# EAGLE design usb_stepper_controller (EAGLE 5.06)
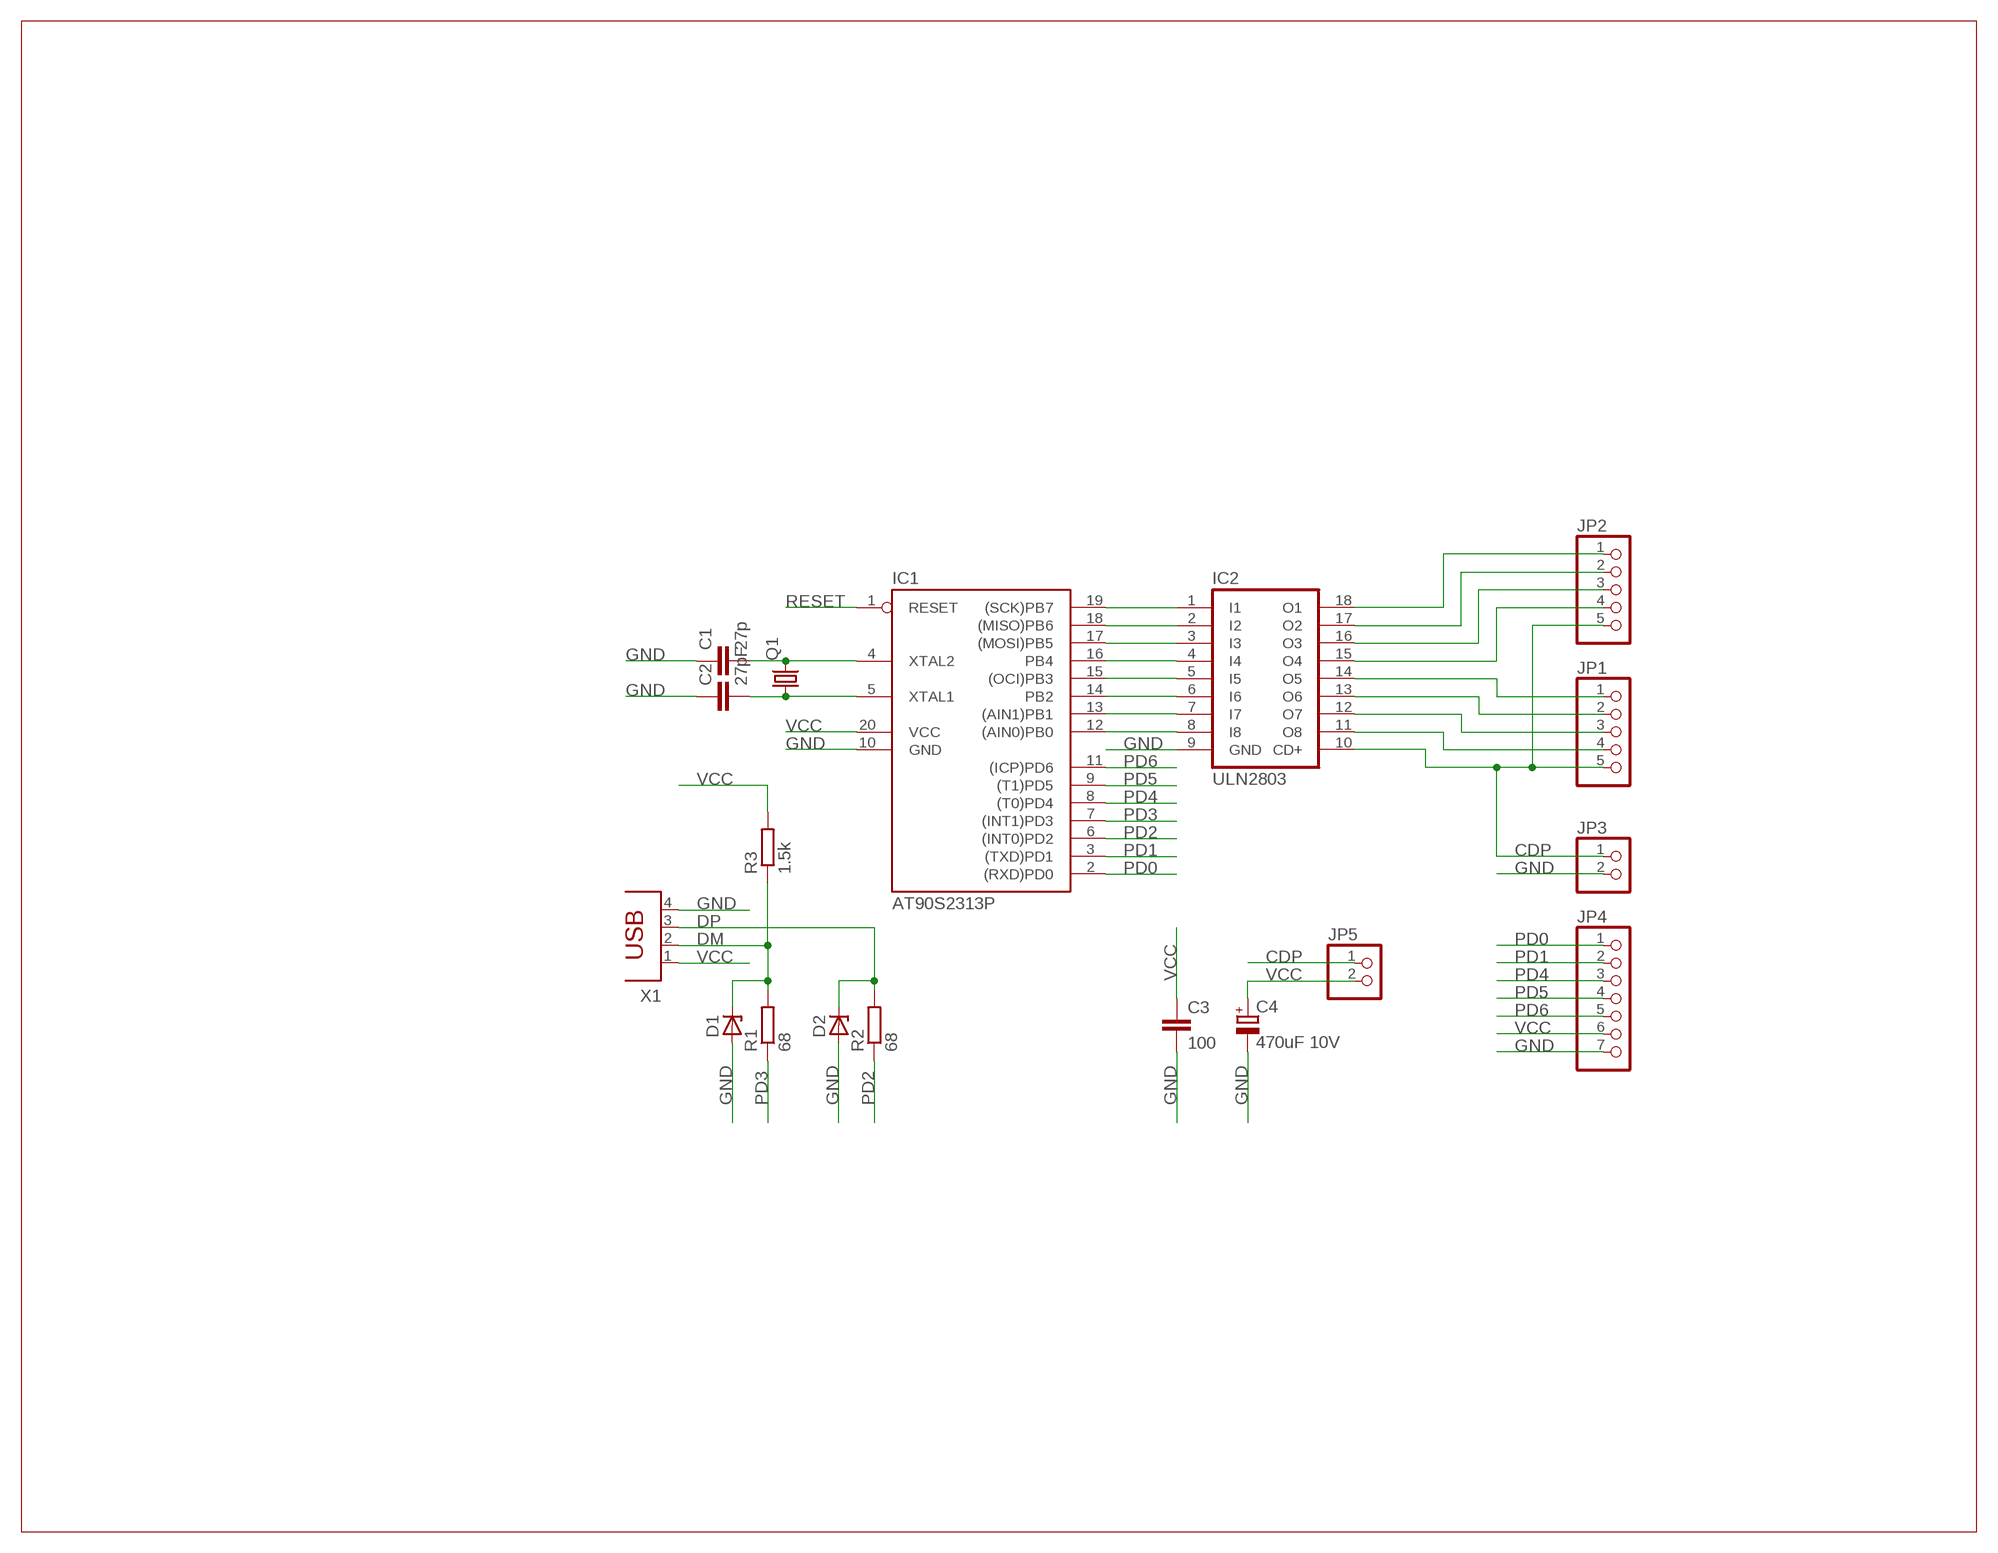
[diagram p0: schematic, sheet 1]

## Parts
C1  27p  C-EUC0805  [C0805]
C2  27pF  C-EUC0805  [C0805]
C3  100  C-EUC1206  [C1206]
C4  470uF 10V  CPOL-EUE3.5-8  [E3,5-8]
D1  ZENER-DIODESOD80C  [SOD80C]
D2  ZENER-DIODESOD80C  [SOD80C]
IC1  AT90S2313P  [DIL20]
IC2  ULN2803  ULN2803A  [DIL18]
JP1  PINHD-1X5  [1X05]
JP2  PINHD-1X5  [1X05]
JP3  PINHD-1X2  [1X02]
JP4  PINHD-1X7  [1X07]
JP5  PINHD-1X2  [1X02]
Q1  CRYSTALHC49S  [HC49/S]
R1  68  R-EU_R0805  [R0805]
R2  68  R-EU_R0805  [R0805]
R3  1.5k  R-EU_R0805  [R0805]
X1  PN61729  [PN61729]

## Nets
CDP: IC2.10(CD+) JP1.5 JP2.5 JP3.1 JP5.1
DM: D1.C R1.2 R3.1 X1.2
DP: D2.C R2.2 X1.3
GND: C1.1 C2.1 C3.2 C4.- D1.A D2.A IC1.10(GND) IC2.9(GND) JP3.2 JP4.7 X1.4
N$1: C1.2 IC1.4(XTAL2) Q1.2
N$2: C2.2 IC1.5(XTAL1) Q1.1
N$3: IC1.19((SCK)PB7) IC2.1(I1)
N$4: IC1.18((MISO)PB6) IC2.2(I2)
N$5: IC1.17((MOSI)PB5) IC2.3(I3)
N$6: IC2.18(O1) JP2.1
N$7: IC2.14(O5) JP1.1
N$8: IC1.16(PB4) IC2.4(I4)
N$9: IC1.15((OCI)PB3) IC2.5(I5)
N$10: IC1.14(PB2) IC2.6(I6)
N$11: IC1.13((AIN1)PB1) IC2.7(I7)
N$12: IC1.12((AIN0)PB0) IC2.8(I8)
N$13: IC2.17(O2) JP2.2
N$14: IC2.16(O3) JP2.3
N$15: IC2.15(O4) JP2.4
N$16: IC2.13(O6) JP1.2
N$17: IC2.12(O7) JP1.3
N$18: IC2.11(O8) JP1.4
PD0: IC1.2((RXD)PD0) JP4.1
PD1: IC1.3((TXD)PD1) JP4.2
PD2: IC1.6((INT0)PD2) R2.1
PD3: IC1.7((INT1)PD3) R1.1
PD4: IC1.8((T0)PD4) JP4.3
PD5: IC1.9((T1)PD5) JP4.4
PD6: IC1.11((ICP)PD6) JP4.5
RESET: IC1.1(RESET)
VCC: C3.1 C4.+ IC1.20(VCC) JP4.6 JP5.2 R3.2 X1.1

## Library data of the parts
C1-C3 = rcl:C-EU: CAPACITOR, European symbol
C4 = rcl:CPOL-EU: POLARIZED CAPACITOR, European symbol
D1 D2 = diode:ZENER-DIODE: Z-Diode
IC1 = atmel:AT90S2313: MICROCONTROLLER 2 Kbytes FLASH 128 bytes SRAM 128 bytes EEPROM UART
IC2 = uln-udn:ULN2803A: DRIVER ARRAY
JP1 JP2 = pinhead:PINHD-1X5: PIN HEADER
JP3 JP5 = pinhead:PINHD-1X2: PIN HEADER
JP4 = pinhead:PINHD-1X7: PIN HEADER
Q1 = crystal:CRYSTAL: CRYSTAL
R1-R3 = rcl:R-EU_: RESISTOR, European symbol
X1 = con-berg:PN61729: BERG USB connector

## Board
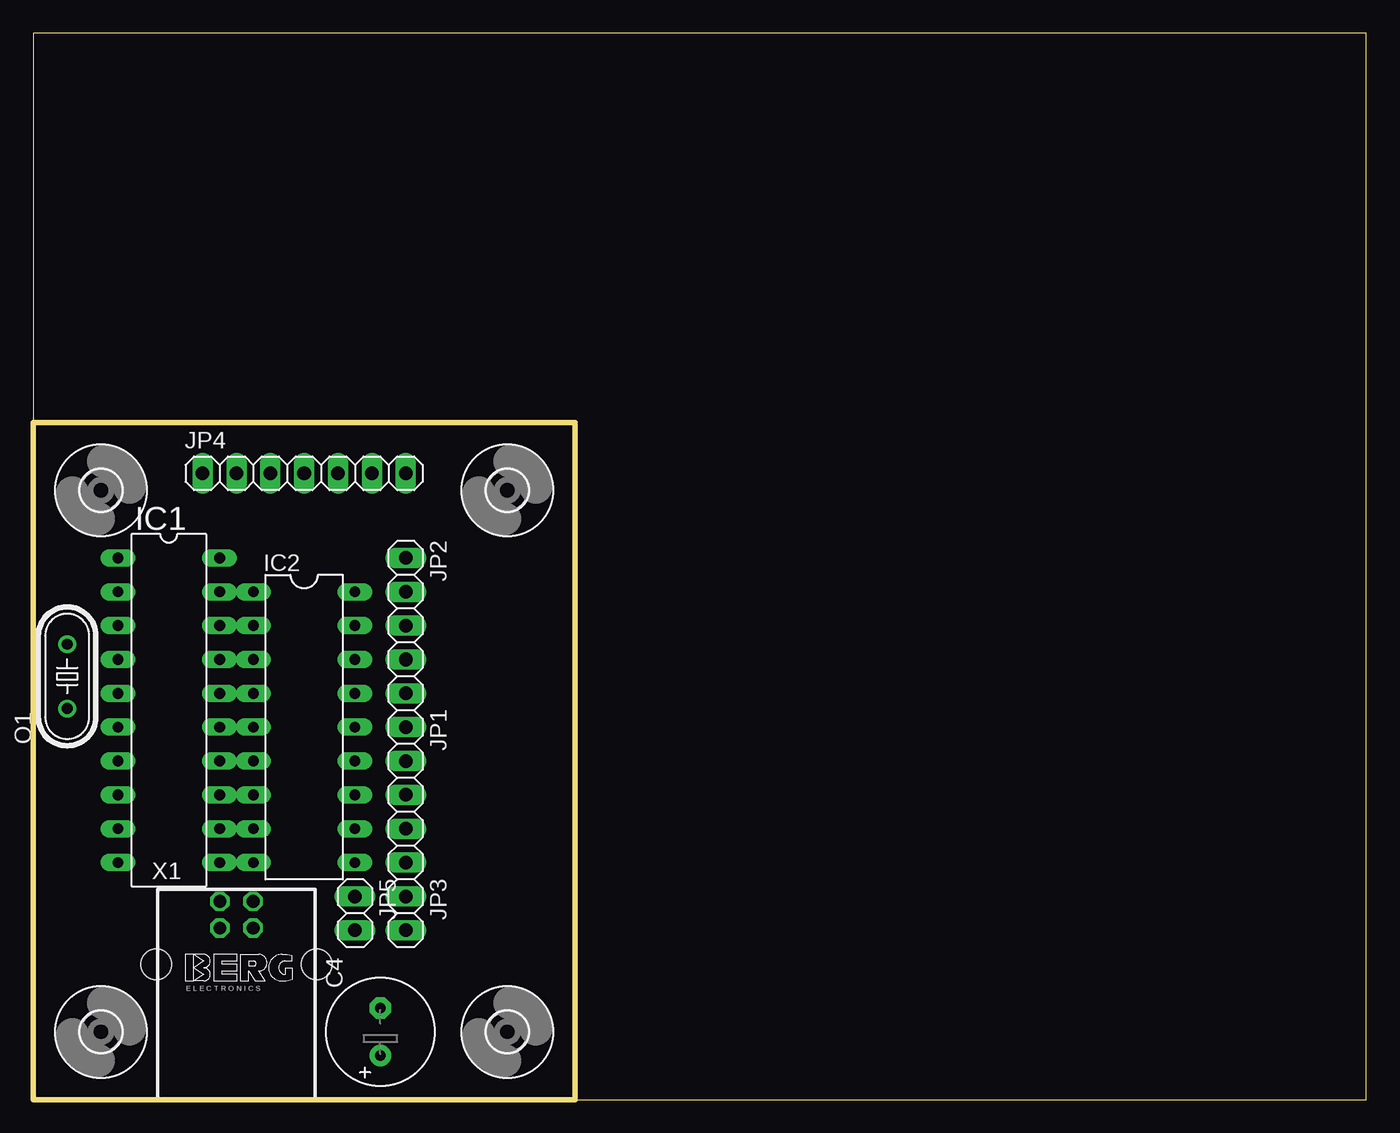
[diagram p1: board, top side]
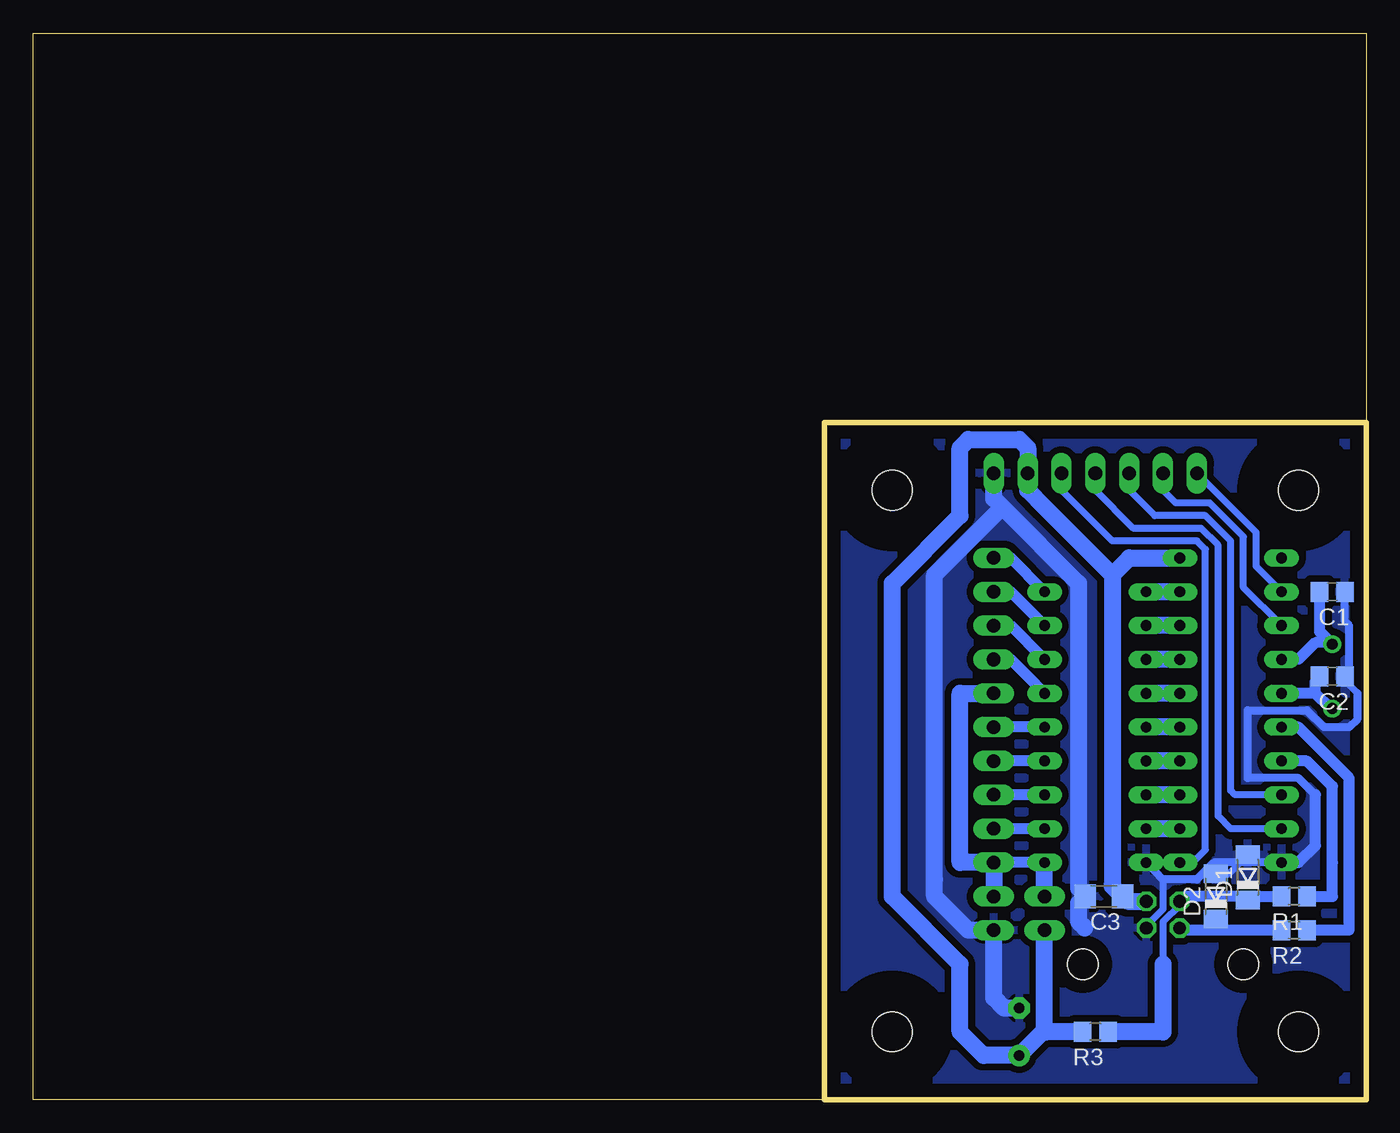
[diagram p2: board, bottom side, seen from below]

Size 100 x 80 mm. Coordinates in mm from the lower left corner, seen from the top.
Outline: 0,0 100,0 100,80 0,80 0,0
Outline: 0,0 40.64,0 40.64,50.8 0,50.8 0,0
Copper layers (1*16): Top 0.035mm / dielectric 1.5mm / Bottom 0.035mm
Design rules "default": minimum track width 10mil, minimum drill 24mil, track to track 8mil, track to pad 8mil, pad to pad 8mil, via to via 8mil, smd to smd 8mil, copper to edge 40mil, drill to drill 8mil, minimum pad ring 10mil, minimum via ring 8mil, stop-mask expansion 4mil, vias tented up to drill 0mil, thermal gap 10mil

### Footprints (pad centres in the part's own frame; a part is rotated, then mirrored left to right if it is on the bottom)
C0805 = smd 1.3 x 1.5: 1 -0.95,0; 2 0.95,0
C1206 = smd 1.6 x 1.8: 1 -1.4,0; 2 1.4,0
E3,5-8 = drill 0.813 pad 1.6 round: + -1.778,0 | drill 0.813 pad 1.6 octagon: - 1.778,0
SOD80C = smd 1.4 x 1.8: A 1.7,0; C -1.7,0
DIL20 = drill 0.813 long: 1 -11.43,-3.81; 2 -8.89,-3.81; 3 -6.35,-3.81; 4 -3.81,-3.81; 5 -1.27,-3.81; 6 1.27,-3.81; 7 3.81,-3.81; 8 6.35,-3.81; 9 8.89,-3.81; 10 11.43,-3.81; 11 11.43,3.81; 12 8.89,3.81; 13 6.35,3.81; 14 3.81,3.81; 15 1.27,3.81; 16 -1.27,3.81; 17 -3.81,3.81; 18 -6.35,3.81; 19 -8.89,3.81; 20 -11.43,3.81
DIL18 = drill 0.813 long: 1 -10.16,-3.81; 2 -7.62,-3.81; 3 -5.08,-3.81; 4 -2.54,-3.81; 5 0,-3.81; 6 2.54,-3.81; 7 5.08,-3.81; 8 7.62,-3.81; 9 10.16,-3.81; 10 10.16,3.81; 11 7.62,3.81; 12 5.08,3.81; 13 2.54,3.81; 14 0,3.81; 15 -2.54,3.81; 16 -5.08,3.81; 17 -7.62,3.81; 18 -10.16,3.81
1X05 = drill 1.016 long: 1 -5.08,0; 2 -2.54,0; 3 0,0; 4 2.54,0; 5 5.08,0
1X02 = drill 1.016 long: 1 -1.27,0; 2 1.27,0
1X07 = drill 1.016 long: 1 -7.62,0; 2 -5.08,0; 3 -2.54,0; 4 0,0; 5 2.54,0; 6 5.08,0; 7 7.62,0
HC49/S = drill 0.813 round: 1 -2.413,0; 2 2.413,0
R0805 = smd 1.3 x 1.5: 1 -0.95,0; 2 0.95,0
3,0 = hole 3: 0,0
PN61729 = drill 0.95 octagon: 1 1.25,4.71; 2 -1.25,4.71; 3 -1.25,2.71; 4 1.25,2.71 | hole 2.3: -6.02,0; 6.02,0

### Placement (x,y rotation side)
C1  [C0805]  2.54,38.1 180 bottom
C2  [C0805]  2.54,31.75 180 bottom
C3  19.68,15.24 180 bottom
C4  26.04,5.08 90 top
D1  8.89,16.67 90 bottom
D2  11.27,15.24 90 bottom
IC1  10.16,29.21 270 top
IC2  [DIL18]  20.32,27.94 270 top
JP1  27.94,22.86 270 top
JP2  27.94,35.56 270 top
JP3  27.94,13.97 270 top
JP4  20.32,46.99 0 top
JP5  24.13,13.97 270 top
Q1  2.54,31.75 90 top
R1  5.4,15.24 180 bottom
R2  5.4,12.7 180 bottom
R3  20.32,5.08 180 bottom
U$1  [3,0]  5.08,5.08 0 top
U$2  [3,0]  35.56,5.08 0 top
U$3  [3,0]  35.56,45.72 0 top
U$4  [3,0]  5.08,45.72 0 top
X1  15.24,10.16 0 top

### Tracks (layer width: path | path; a pad name or v marks a point on that pad's centre or on a via)
CDP
  Bottom 0.813: IC2.10 JP1.5
  Bottom 1.27: JP2.5 30.48,30.48 30.48,17.78 JP1.5 JP3.1 | JP5.1 IC2.10
DM
  Bottom 0.508: X1.2 13.99,14.59 15.24,13.34 15.24,10.16 | D1.C 8.21,14.97 7.94,15.24
  Bottom 0.813: R1.2 7.94,15.24 13.62,15.24 X1.2
  Bottom 1.27: R3.1 15.24,5.08 15.24,10.16
DP
  Bottom 0.508: 11.27,12.7 D2.C
  Bottom 0.813: R2.2 11.27,12.7 13.82,12.7 X1.3
GND
  Bottom 0.508: C2.1 1.59,31.43 0.64,30.48 | 15.24,16.51 15.24,14.29 16.19,13.34 16.19,13.17 X1.4 | 10.79,17.78 11.27,17.62 D2.A 10.32,16.94 D1.A
  Bottom 0.61: 15.24,16.51 15.88,17.14 | 15.88,17.14 IC2.9 15.88,17.14 | 15.24,16.51 15.88,17.14 | 15.24,16.51 12.7,16.51 11.43,17.78 10.79,17.78 IC1.10 | C1.1 1.59,35.88 1.27,35.56 1.27,32.07 C2.1 | 0.64,30.48 0.64,28.57 1.27,27.94 3.17,27.94 4.45,29.21 8.89,29.21 8.89,24.13 5.08,24.13 3.81,22.86
  Bottom 0.813: 3.81,22.86 3.81,19.05 5.08,17.78 IC1.10
  Bottom 1.27: JP4.7 27.94,45.09 27.3,44.45 | 21.59,15.88 21.59,38.73 27.3,44.45 | 27.3,44.45 32.38,39.37 32.38,16.51 32.38,15.24 29.84,12.7 JP3.2 27.94,7.62 27.18,6.86 C4.- | 21.12,12.87 21.59,13.34 21.59,14.73 C3.2
  pour Bottom (isolate 0.508): 0,0 40.64,0 40.64,50.8 0,50.8
N$1
  Bottom 0.813: C1.2 3.49,35.11 Q1.2 2.67,34.29 3.81,34.29 5.08,33.02 IC1.4
N$2
  Bottom 0.813: Q1.1 2.67,29.34 3.81,30.48 | 3.81,30.48 3.81,31.43 C2.2 | 3.81,30.48 IC1.5
N$3
  Bottom 1.27: IC1.19 IC2.1
N$4
  Bottom 1.27: IC1.18 IC2.2
N$5
  Bottom 1.27: IC1.17 IC2.3
N$6
  Bottom 0.813: IC2.18 26.67,40.64 JP2.1
N$7
  Bottom 0.813: IC2.14 JP1.1
N$8
  Bottom 1.27: IC1.16 IC2.4
N$9
  Bottom 1.27: IC1.15 IC2.5
N$10
  Bottom 1.27: IC1.14 IC2.6
N$11
  Bottom 1.27: IC1.13 IC2.7
N$12
  Bottom 1.27: IC1.12 IC2.8
N$13
  Bottom 0.813: IC2.17 26.67,38.1 JP2.2
N$14
  Bottom 0.813: IC2.16 26.67,35.56 JP2.3
N$15
  Bottom 0.813: IC2.15 25.4,31.75 26.67,33.02 JP2.4
N$16
  Bottom 0.813: IC2.13 JP1.2
N$17
  Bottom 0.813: IC2.12 JP1.3
N$18
  Bottom 0.813: IC2.11 JP1.4
PD0
  Bottom 0.508: IC1.2 8.26,40.01 8.26,42.55 JP4.1
PD1
  Bottom 0.508: IC1.3 9.21,38.42 9.21,42.23 11.75,44.77 14.29,44.77 15.24,45.72 JP4.2
PD2
  Bottom 0.813: IC1.6 5.08,27.94 1.27,24.13 1.27,16.51 1.27,12.7 R2.1
PD3
  Bottom 0.813: R1.1 2.54,15.24 2.54,17.78 2.54,23.5 4.45,25.4 IC1.7
PD4
  Bottom 0.508: IC1.8 9.84,22.86 10.16,23.18 10.16,41.91 12.06,43.81 15.88,43.81 17.78,45.72 JP4.3
PD5
  Bottom 0.508: IC1.9 10.16,20.32 11.11,21.27 11.11,41.59 12.38,42.86 17.46,42.86 20.32,45.72 JP4.4
PD6
  Bottom 0.508: IC1.11 13.02,17.78 12.06,18.73 12.06,41.27 12.7,41.91 19.05,41.91 22.86,45.72 JP4.5
VCC
  Bottom 1.27: 19.05,39.37 17.78,40.64 IC1.20 | 19.05,39.37 24.13,44.45 25.4,45.72 JP4.6 25.4,48.9 26.04,49.53 29.84,49.53 30.48,48.9 30.48,43.81 35.56,38.73 35.56,15.24 30.48,10.16 30.48,5.08 28.7,3.3 C4.+ 24.13,5.21 | 19.05,39.37 19.05,16.14 19.05,16 C3.1 17.91,14.87 X1.1 | 24.13,5.21 JP5.2 | R3.2 24,5.08 24.13,5.21